# Altium schematic sheet PowerDistribution.SchDoc (part 1 of 3)
size B; SheetNumber: 4; SheetTotal: 11
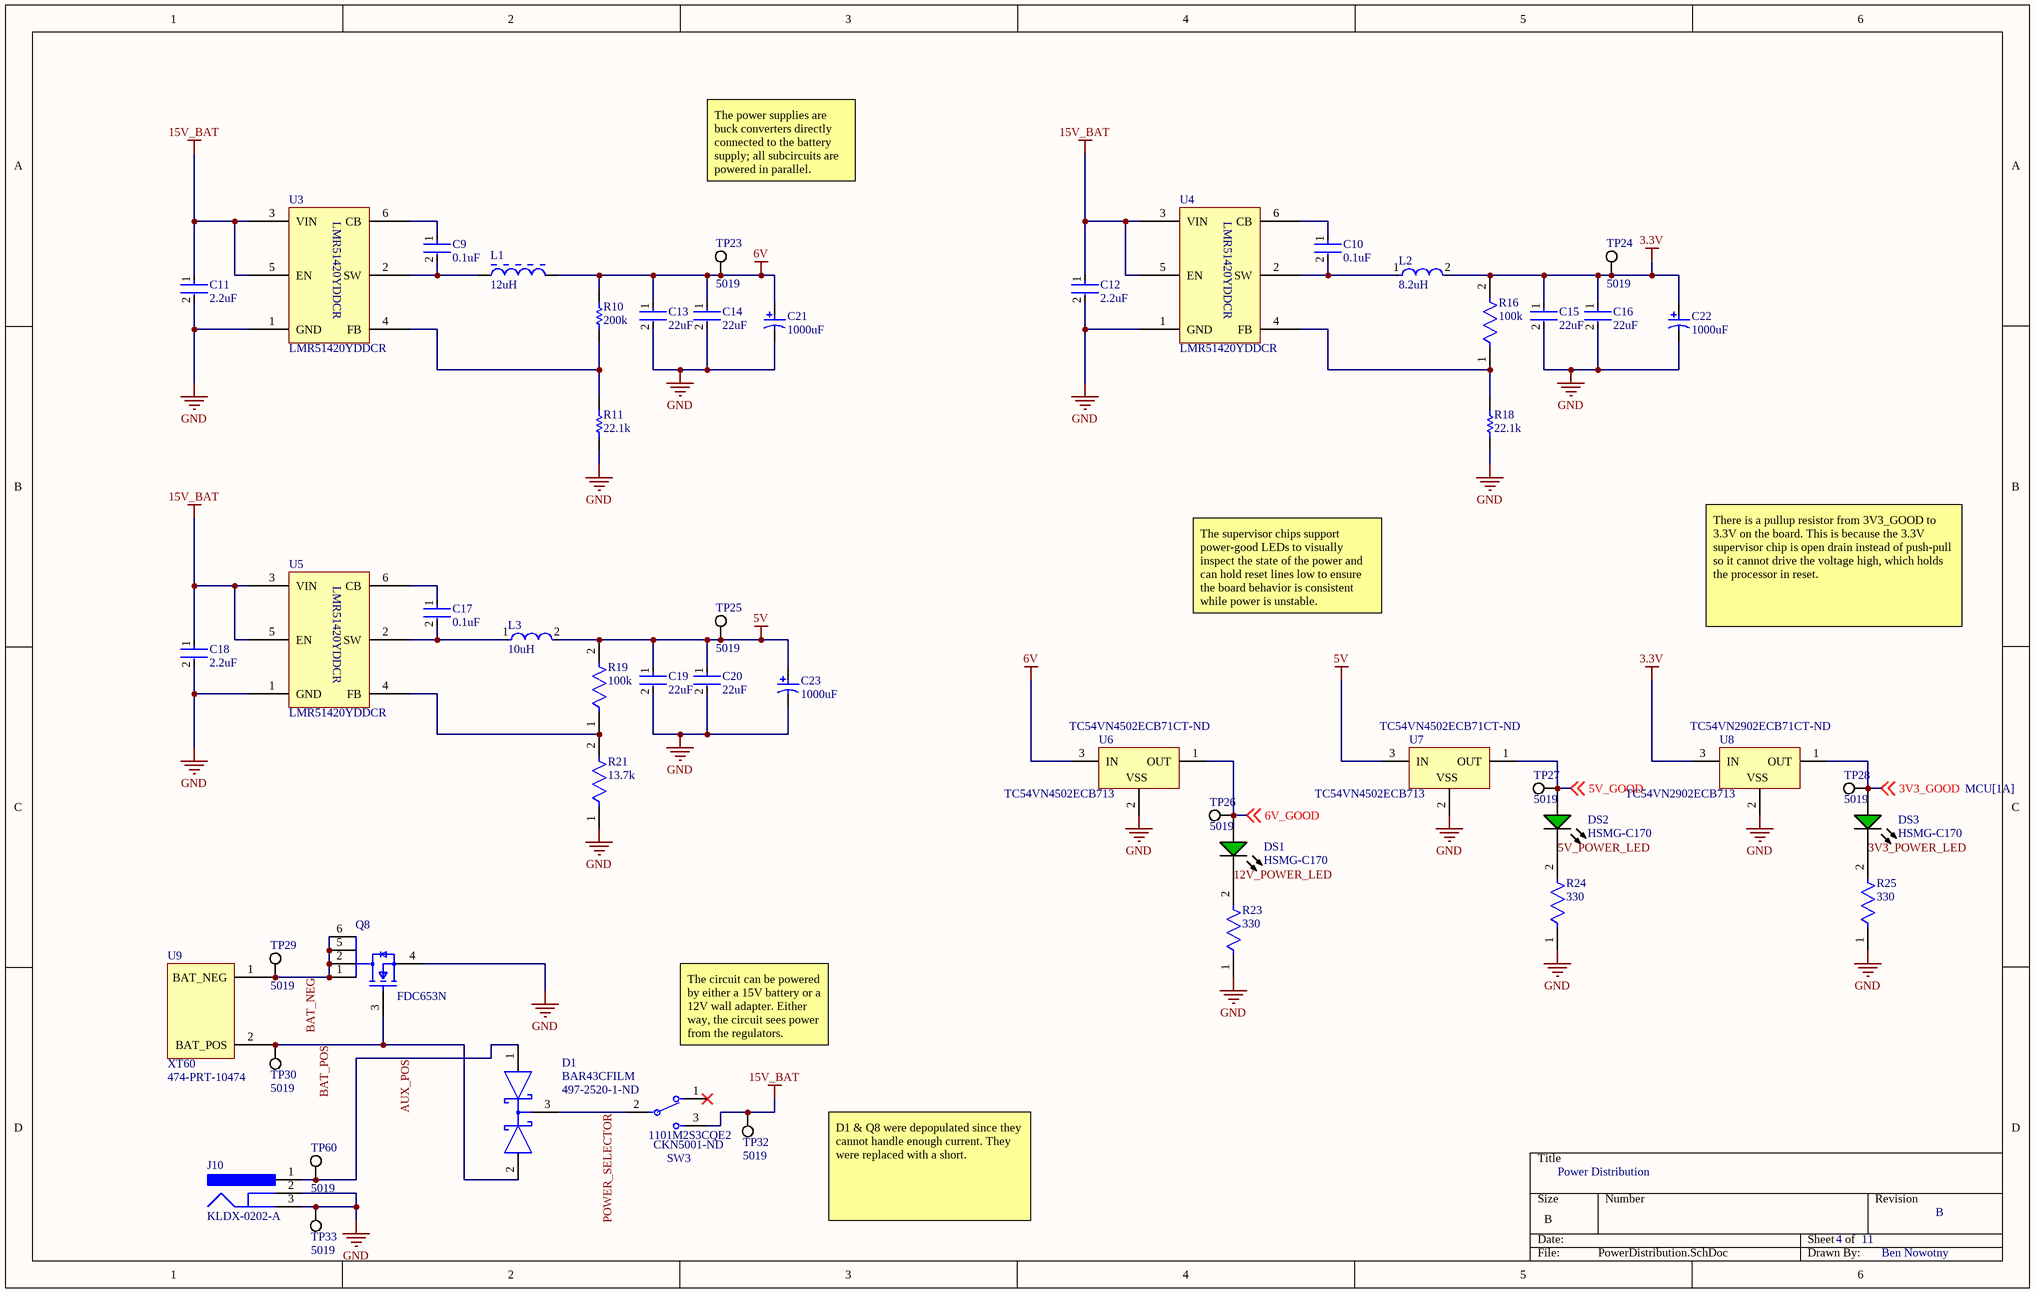
[diagram p0: PowerDistribution.SchDoc]

## Parts
C9  0.1uF  [FP-CC0805-0_85-MFG]
C10  0.1uF  [FP-CC0805-0_85-MFG]
C11  2.2uF  [FP-CGA4J-IPC_A]
C12  2.2uF  [FP-CGA4J-IPC_A]
C13  22uF  [FP-GRM21B-0_2-e0_2_0_7-IPC_B]
C14  22uF  [FP-GRM21B-0_2-e0_2_0_7-IPC_B]
C15  22uF  [FP-GRM21B-0_2-e0_2_0_7-IPC_B]
C16  22uF  [FP-GRM21B-0_2-e0_2_0_7-IPC_B]
C17  0.1uF  [FP-CC0805-0_85-MFG]
C18  2.2uF  [FP-CGA4J-IPC_A]
C19  22uF  [FP-GRM21B-0_2-e0_2_0_7-IPC_B]
C20  22uF  [FP-GRM21B-0_2-e0_2_0_7-IPC_B]
C21  1000uF  [NIC-CAPA2-10X10_V]
C22  1000uF  [NIC-CAPA2-10X10_V]
C23  1000uF  [NIC-CAPA2-10X10_V]
D1  BAR43CFILM  Supplier Part Number 1: 497-2520-1-ND  [FP-SOT23-3L-MFG]
DS1  HSMG-C170  [AVAG-HSMX-C170_V]
DS2  HSMG-C170  [AVAG-HSMX-C170_V]
DS3  HSMG-C170  [AVAG-HSMX-C170_V]
J10  KLDX-0202-A  [KYCN-KLDX-0202-A_V]
L1  12uH  [BOUR-SDR0403-2_V]
L2  8.2uH  [FP-SRP4020TA-MFG]
L3  10uH  [FP-LB2012-1_25-0_2-MFG]
Q8  FDC653N  [FP-419BL-MFG]
R10  200k  [RESC2013X50X30NL20T20]
R11  22.1k  [RESC2013X70X40NL20T20]
R16  100k  [FP-RC0805-0_6-IPC_C]
R18  22.1k  [RESC2013X70X40NL20T20]
R19  100k  [FP-RC0805-0_6-IPC_C]
R21  13.7k  [FP-CRCW0805-e3-IPC_A]
R23  330  [FP-CRCW0805-e3-MFG]
R24  330  [FP-CRCW0805-e3-MFG]
R25  330  [FP-CRCW0805-e3-MFG]
SW3  1101M2S3CQE2  Supplier Part Number 1: CKN5001-ND  [FP-1101M2S3CQE2-MFG]
TP23  5019  [KSTN-5019_V]
TP24  5019  [KSTN-5019_V]
TP25  5019  [KSTN-5019_V]
TP26  5019  [KSTN-5019_V]
TP27  5019  [KSTN-5019_V]
TP28  5019  [KSTN-5019_V]
TP29  5019  [KSTN-5019_V]
TP30  5019  [KSTN-5019_V]
TP32  5019  [KSTN-5019_V]
TP33  5019  [KSTN-5019_V]
TP60  5019  [KSTN-5019_V]
U3  LMR51420YDDCR  [BUCK_REG_FOOTPRINT_SOT95P280X110-6N]
U4  LMR51420YDDCR  [BUCK_REG_FOOTPRINT_SOT95P280X110-6N]
U5  LMR51420YDDCR  [BUCK_REG_FOOTPRINT_SOT95P280X110-6N]
U6  TC54VN4502ECB713  Supplier Part Number 1: TC54VN4502ECB71CT-ND  [SOT-23A-CB3_L]
U7  TC54VN4502ECB713  Supplier Part Number 1: TC54VN4502ECB71CT-ND  [SOT-23A-CB3_L]
U8  TC54VN2902ECB713  Supplier Part Number 1: TC54VN2902ECB71CT-ND  [SOT-23A-CB3_L]
U9  XT60  Supplier Part Number 1: 474-PRT-10474  [XT60]

## Nets
3.3V: C15.1 C16.1 C22.1 L2.2 R16.2 TP24.1 U8.3(IN)
5V: C19.1 C20.1 C23.1 L3.2 R19.2 TP25.1 U7.3(IN)
6V: C13.1 C14.1 C21.1 L1.2 R10.2 TP23.1 U6.3(IN)
15V_BAT: C11.1 C12.1 C18.1 SW3.3 TP32.1 U3.3(VIN) U3.5(EN) U4.3(VIN) U4.5(EN) U5.3(VIN) U5.5(EN)
GND: C11.2 C12.2 C13.2 C14.2 C15.2 C16.2 C18.2 C19.2 C20.2 C21.2 C22.2 C23.2 J10.2 J10.3 Q8.4(S) R11.1 R18.1 R21.1 R23.1 R24.1 R25.1 TP33.1 U3.1(GND) U4.1(GND) U5.1(GND) U6.2(VSS) U7.2(VSS) U8.2(VSS)
3V3_GOOD: DS3.1(A) TP28.1 U8.1(OUT) ; off-sheet 3V3_GOOD
3V3_POWER_LED: DS3.2(K) R25.2
5V_GOOD: DS2.1(A) TP27.1 U7.1(OUT) ; off-sheet 5V_GOOD
5V_POWER_LED: DS2.2(K) R24.2
6V_GOOD: DS1.1(A) TP26.1 U6.1(OUT) ; off-sheet 6V_GOOD
12V_POWER_LED: DS1.2(K) R23.2
AUX_POS: D1.1(A1) J10.1 TP60.1
BAT_NEG: Q8.1(D) Q8.2(D) Q8.5(D) Q8.6(D) TP29.1 U9.1(BAT_NEG)
BAT_POS: D1.2(A2) Q8.3(G) TP30.1 U9.2(BAT_POS)
POWER_SELECTOR: D1.3(K) SW3.2(COMM)
NetC9_1: C9.1 U3.6(CB)
NetC9_2: C9.2 L1.1 U3.2(SW)
NetC10_1: C10.1 U4.6(CB)
NetC10_2: C10.2 L2.1 U4.2(SW)
NetC17_1: C17.1 U5.6(CB)
NetC17_2: C17.2 L3.1 U5.2(SW)
NetR10_1: R10.1 R11.2 U3.4(FB)
NetR16_1: R16.1 R18.2 U4.4(FB)
NetR19_1: R19.1 R21.2 U5.4(FB)

Not connected (* = marked no-connect by the designer): SW3 1*

## Notes on the sheet
- The power supplies are buck converters directly connected to the battery supply; all subcircuits are powered in parallel.
- The supervisor chips support power-good LEDs to visually inspect the state of the power and can hold reset lines low to ensure the board behavior is consistent while power is unstable.
- There is a pullup resistor from 3V3_GOOD to 3.3V on the board. This is because the 3.3V supervisor chip is open drain instead of push-pull so it cannot drive the voltage high, which holds the processor in reset.
- The circuit can be powered by either a 15V battery or a 12V wall adapter. Either way, the circuit sees power from the regulators.
- Power Distribution
- D1 & Q8 were depopulated since they cannot handle enough current. They were replaced with a short.
- 11
- B
- Ben Nowotny